# EAGLE schematic IR_Board (EAGLE 6.5.0)
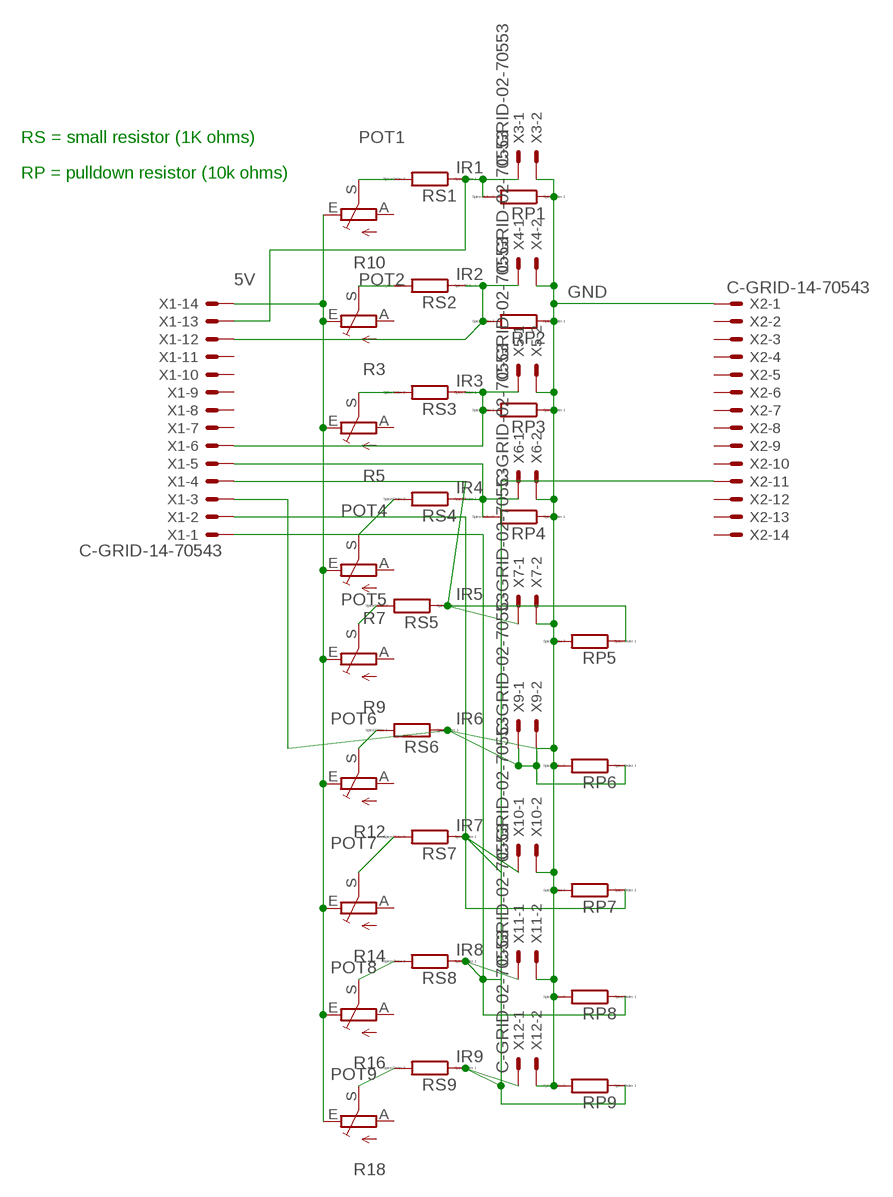
[diagram p0: schematic, sheet 1]

## Parts
R3  TRIM_EU-B25P  [B25P]
R5  TRIM_EU-B25P  [B25P]
R7  TRIM_EU-B25P  [B25P]
R9  TRIM_EU-B25P  [B25P]
R10  TRIM_EU-B25P  [B25P]
R12  TRIM_EU-B25P  [B25P]
R14  TRIM_EU-B25P  [B25P]
R16  TRIM_EU-B25P  [B25P]
R18  TRIM_EU-B25P  [B25P]
RP1  R0204/7  [0204/7]
RP2  R0204/7  [0204/7]
RP3  R0204/7  [0204/7]
RP4  R0204/7  [0204/7]
RP5  R0204/7  [0204/7]
RP6  R0204/7  [0204/7]
RP7  R0204/7  [0204/7]
RP8  R0204/7  [0204/7]
RP9  R0204/7  [0204/7]
RS1  R0204/7  [0204/7]
RS2  R0204/7  [0204/7]
RS3  R0204/7  [0204/7]
RS4  R0204/7  [0204/7]
RS5  R0204/7  [0204/7]
RS6  R0204/7  [0204/7]
RS7  R0204/7  [0204/7]
RS8  R0204/7  [0204/7]
RS9  R0204/7  [0204/7]
X1  C-GRID-14-70543  [70543-14]
X2  C-GRID-14-70543  [70543-14]
X3  C-GRID-02-70553  [70553-02]
X4  C-GRID-02-70553  [70553-02]
X5  C-GRID-02-70553  [70553-02]
X6  C-GRID-02-70553  [70553-02]
X7  C-GRID-02-70553  [70553-02]
X9  C-GRID-02-70553  [70553-02]
X10  C-GRID-02-70553  [70553-02]
X11  C-GRID-02-70553  [70553-02]
X12  C-GRID-02-70553  [70553-02]

## Nets
5V: R3.E R5.E R7.E R9.E R10.E R12.E R14.E R16.E R18.E X1.14
GND: RP1.1 RP2.1 RP3.1 RP4.1 RP5.2 RP6.2 RP7.2 RP8.2 RP9.2 X2.1 X3.2 X4.2 X5.2 X6.2 X7.2 X9.2 X10.2 X11.2 X12.2
IR1: RP1.2 RS1.1 X1.13 X3.1
IR2: RP2.2 RS2.1 X1.12 X4.1
IR3: RP3.2 RS3.1 X1.6 X5.1
IR4: RP4.2 RS4.1 X1.5 X6.1
IR5: RP5.1 RS5.1 X1.4 X7.1
IR6: RP6.1 RS6.1 X1.3 X9.1
IR7: RP7.1 RS7.1 X1.2 X10.1
IR8: RP8.1 RS8.1 X1.1 X11.1
IR9: RP9.1 RS9.1 X2.11 X12.1
POT1: R10.S RS1.2
POT2: R3.S RS2.2
POT3: R5.S RS3.2
POT4: R7.S RS4.2
POT5: R9.S RS5.2
POT6: R12.S RS6.2
POT7: R14.S RS7.2
POT8: R16.S RS8.2
POT9: R18.S RS9.2
Unconnected: R3.A R5.A R7.A R9.A R10.A R12.A R14.A R16.A R18.A X1.7 X1.8 X1.9 X1.10 X1.11 X2.2 X2.3 X2.4 X2.5 X2.6 X2.7 X2.8 X2.9 X2.10 X2.12 X2.13 X2.14

## Notes on the sheet
- RS = small resistor (1K ohms)
- RP = pulldown resistor (10k ohms)

## Library data of the parts
R3 R5 R7 R9 R10 R12 R14 R16 R18 = pot:TRIM_EU-: POTENTIOMETER
RP1-RP9 RS1-RS9 = eagle-ltspice:R: RESISTOR, European symbol; SPICEMODEL: NONE; SPICEPREFIX: R
X1 X2 = con-molex:C-GRID-14: CONNECTOR wire to board 2.54 mm (0.100") pitch header; OC_FARNELL: unknown; OC_NEWARK: unknown
X3-X7 X9-X12 = con-molex:C-GRID-02: CONNECTOR wire to board 2.54 mm (0.100") pitch header; OC_FARNELL: unknown; OC_NEWARK: unknown

## Net classes
0 default: width 0.406 mm